# EasyEDA schematic SCH_Trabalho-AP1-Subtrator_2024-10-15.json
TITLE: Daniel Studart, Davi Jacob e João Paulo Dopcke; REV: 1.0; Date: 2024-10-15; Sheet: 1/1; Drawn By: jpaulovascon1710; Company: IBMEC
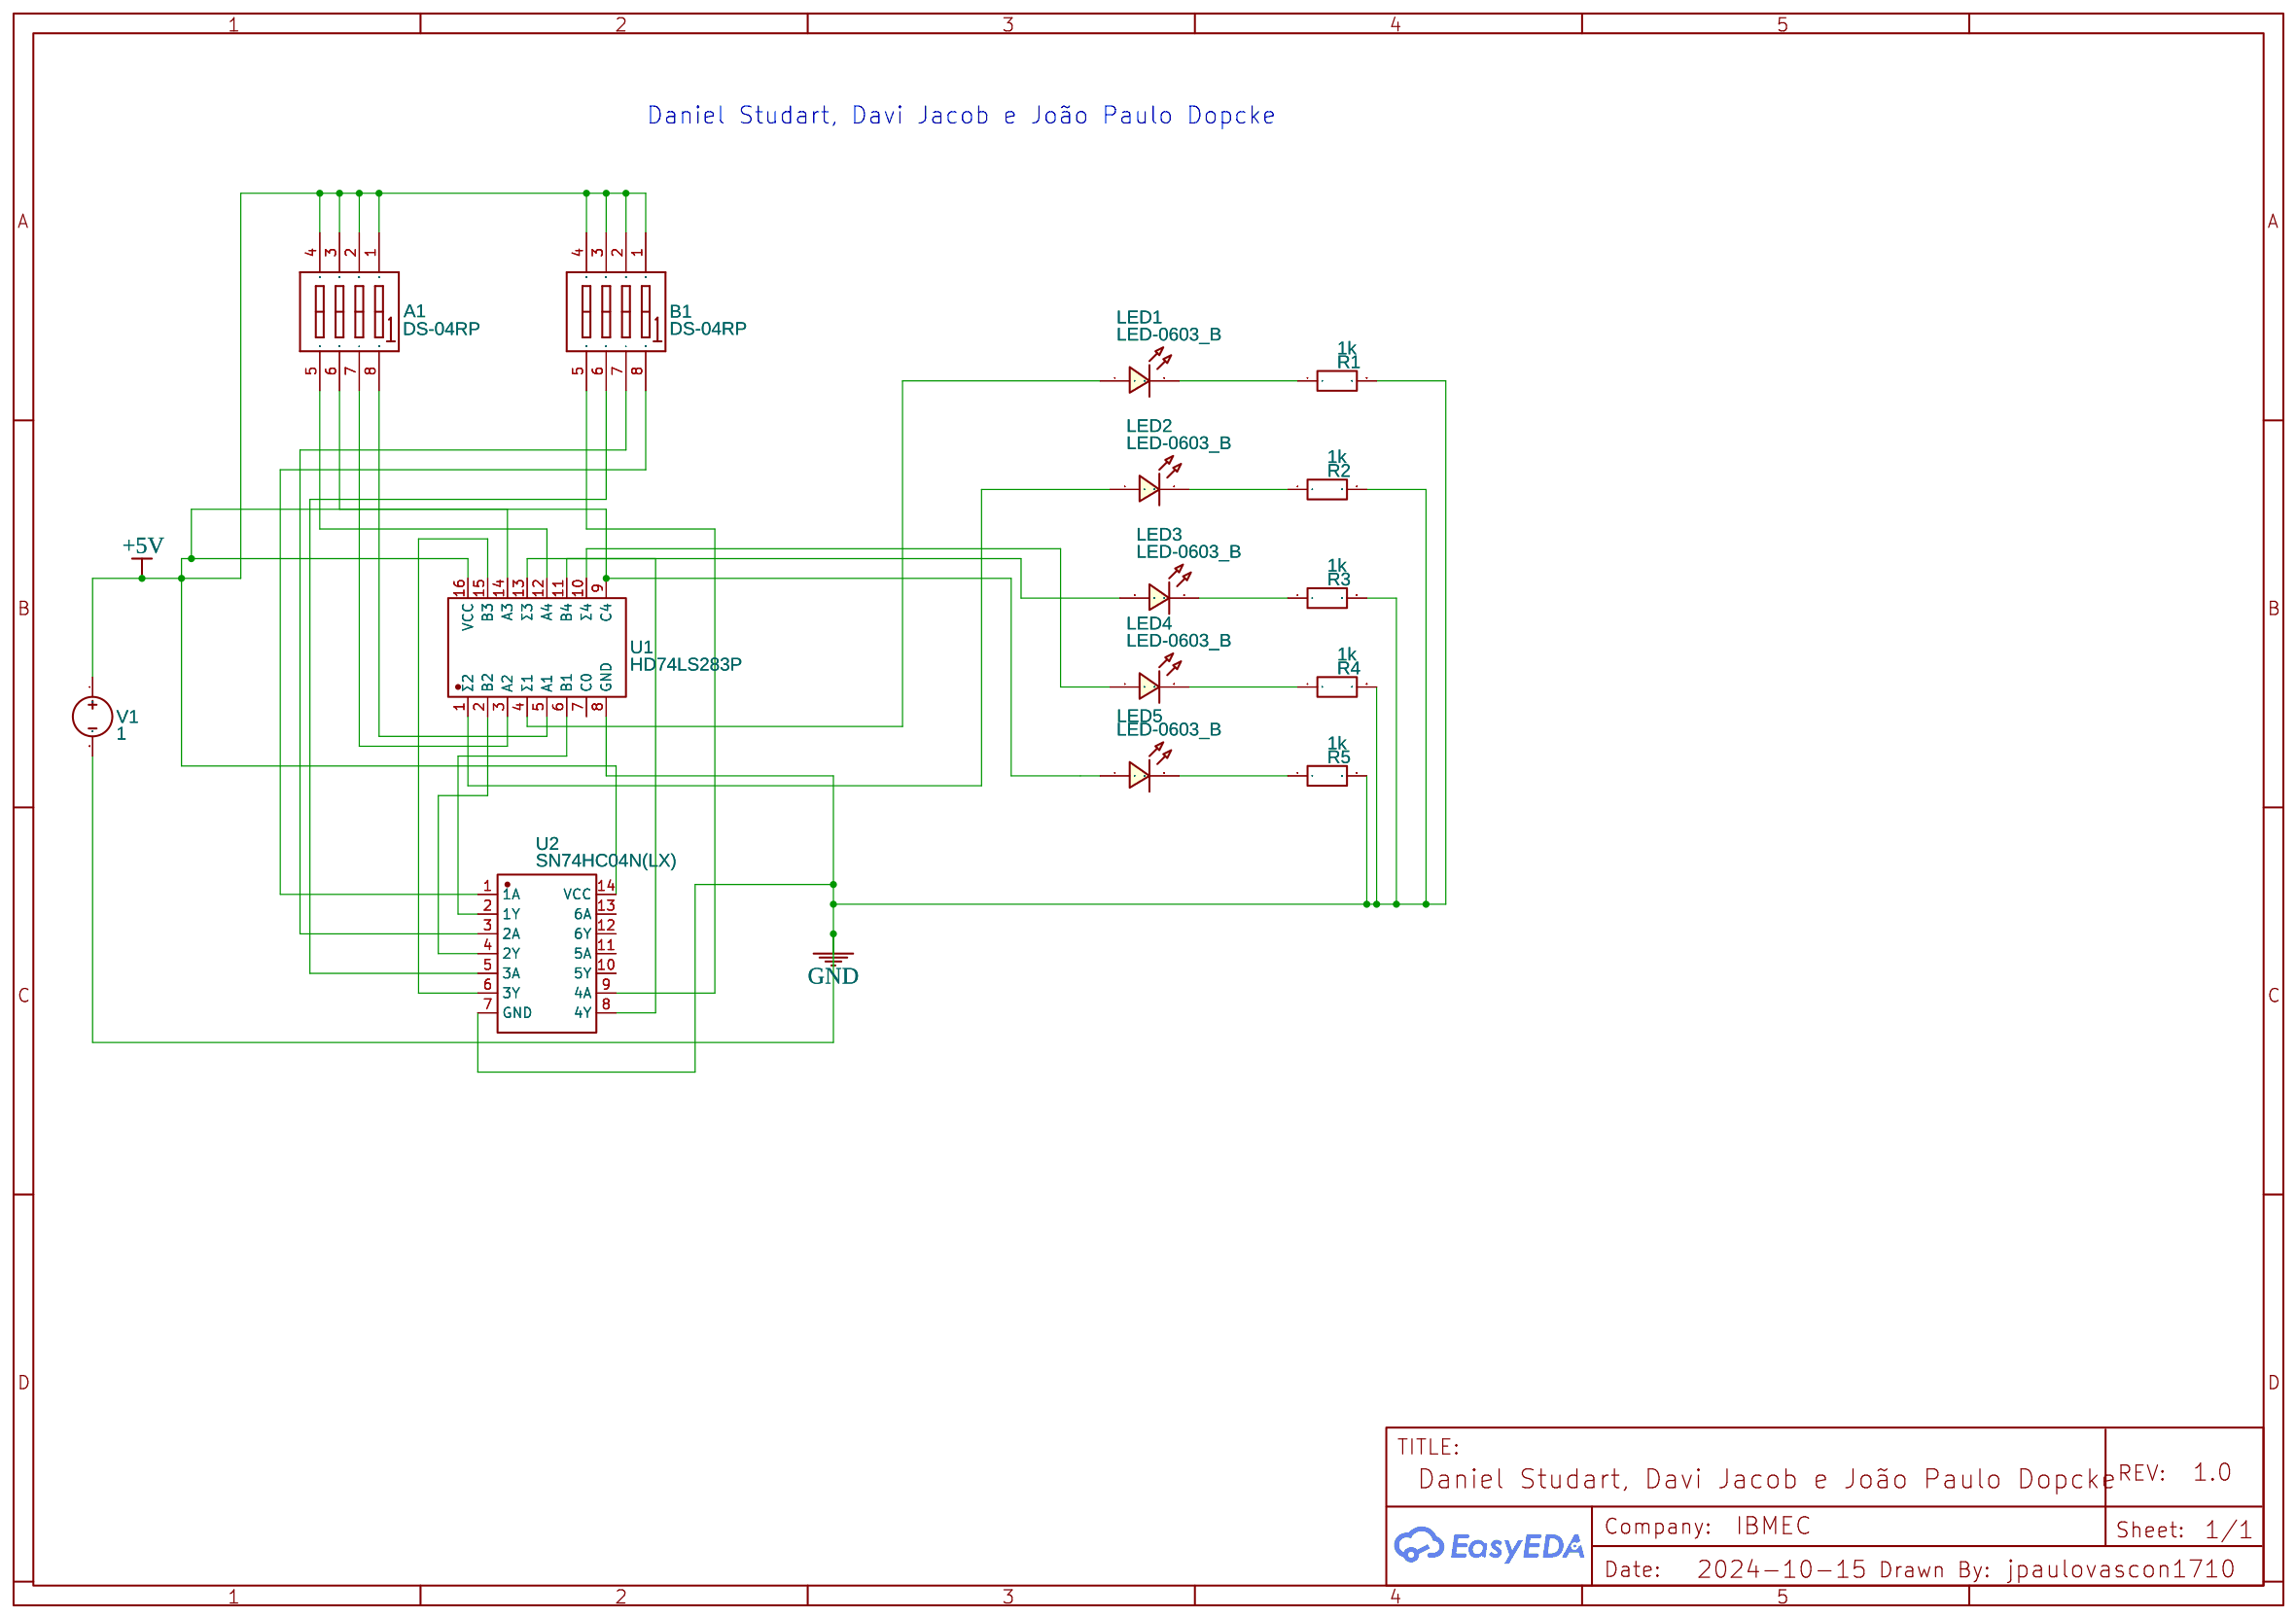
[diagram p0: schematic sheet]

## Parts
A1  DS-04RP  [SW-TH_DS-04XP]
B1  DS-04RP  [SW-TH_DS-04XP]
LED1  LED-0603_B  [LED0603_BLUE]
LED2  LED-0603_B  [LED0603_BLUE]
LED3  LED-0603_B  [LED0603_BLUE]
LED4  LED-0603_B  [LED0603_BLUE]
LED5  LED-0603_B  [LED0603_BLUE]
R1  1k  [R0603]
R2  1k  [R0603]
R3  1k  [R0603]
R4  1k  [R0603]
R5  1k  [R0603]
U1  HD74LS283P  [PDIP-16_L19.3-W6.4-P2.54-LS7.94-BL]
U2  SN74HC04N(LX)  [DIP-14_L19.6-W6.4-P2.54-LS7.6-BL]
V1  1  [HDR1X2]

## Library data of the parts
A1 B1 = DS-04RP: Supplier: LCSC; Manufacturer: 韩国韩荣; Supplier Part: C92645; JLCPCB Part Class: Extended Part
LED1-LED5 = LED-0603_B: Manufacturer: EVERLIGHT(台湾亿光); Manufacturer Part: 19-217/BHC-ZL1M2RY/3T; Supplier Part: C72041; Supplier: LCSC; Contributor: LCEDA_01
R1-R5 = R_0603_EU: Contributor: LCEDA_Lib
U1 = SN74LS283N: Contributor: LCSC; Supplier: LCSC; Supplier Part: C1523494; Manufacturer: TI(德州仪器); JLCPCB Part Class: Extended Part
U2 = SN74HC04N(LX): Supplier: LCSC; Supplier Part: C22436641; Manufacturer: LX(灵星芯微); Contributor: lcsc; JLCPCB Part Class: Extended Part
V1 = VDC: Contributor: EasyEDA; sim: true

## Nets
+5V: A1.1(A1) A1.2(A2) A1.3(A3) A1.4(A4) B1.1(A1) B1.2(A2) B1.3(A3) B1.4(A4) LED5.1 U1.9(C4) U1.16(VCC) U2.14(VCC) V1.1
GND: R1.2 R2.2 R3.2 R4.2 R5.2 U1.8(GND) U2.7(GND) V1.2
Net-(A1-5): A1.5 U1.12(A4)
Net-(A1-6): A1.6 U1.14(A3)
Net-(A1-7): A1.7 U1.3(A2)
Net-(A1-8): A1.8 U1.5(A1)
Net-(B1-5): B1.5 U2.9(4A)
Net-(B1-6): B1.6 U2.5(3A)
Net-(B1-7): B1.7 U2.3(2A)
Net-(B1-8): B1.8 U2.1(1A)
Net-(LED1-1): LED1.1 U1.4(Σ1)
Net-(LED1-2): LED1.2 R1.1
Net-(LED2-1): LED2.1 U1.1(Σ2)
Net-(LED2-2): LED2.2 R2.1
Net-(LED3-1): LED3.1 U1.13(Σ3)
Net-(LED3-2): LED3.2 R3.1
Net-(LED4-1): LED4.1 U1.10(Σ4)
Net-(LED4-2): LED4.2 R4.1
Net-(LED5-2): LED5.2 R5.1
Net-(U1-2): U1.2(B2) U2.4(2Y)
Net-(U1-6): U1.6(B1) U2.2(1Y)
Net-(U1-11): U1.11(B4) U2.8(4Y)
Net-(U1-15): U1.15(B3) U2.6(3Y)

Not connected (* = marked no-connect by the designer): U1 7(C0); U2 10(5Y) 11(5A) 12(6Y) 13(6A)

## Notes on the sheet
- Daniel Studart, Davi Jacob e João Paulo Dopcke
